# EAGLE design PH_074_isolated_SMD_rev1_2 (EAGLE 6.4)
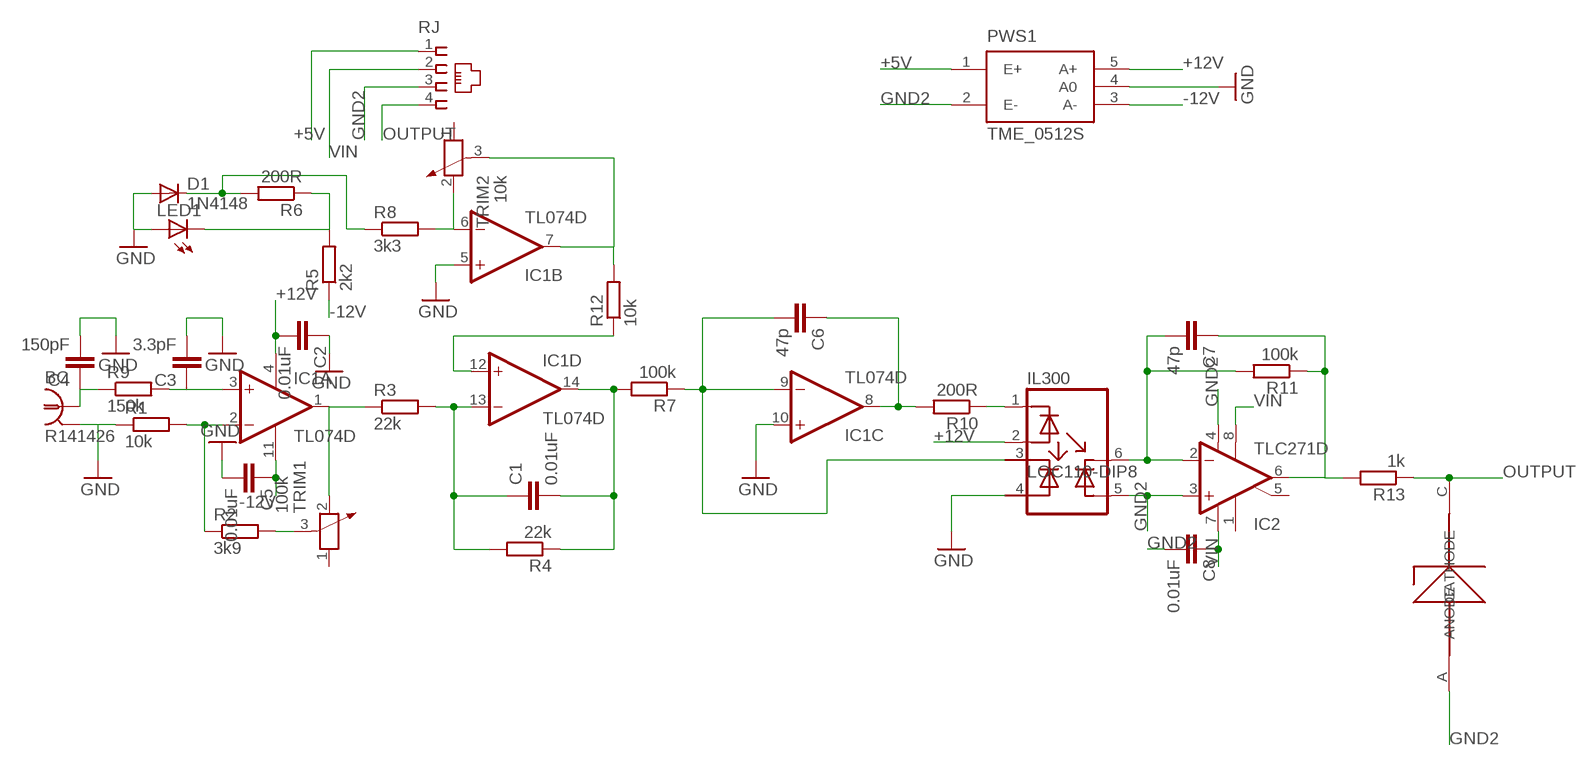
[diagram p0: schematic, sheet 1]

## Parts
BC  R141426  [R141426]
C1  0.01uF  C-EUC1206  [C1206]
C2  0.01uF  C-EUC1206  [C1206]
C3  3.3pF  C-EUC0805  [C0805]
C4  150pF  C-EUC0805  [C0805]
C5  0.01uF  C-EUC0805  [C0805]
C6  47p  C-EUC0805  [C0805]
C7  47p  C-EUC1206  [C1206]
C8  0.01uF  C-EUC0805  [C0805]
D1  1N4148  [R1206W]
IC1  TL074D  [SO14]
IC2  TLC271D  [SO08]
IL300  LOC110-DIP8  ILD621LOC110-DIP8  [DIP8]
LED1  LED3MM  [LED3MM]
PWS1  TME_0512S  [TMEXXXXS]
R1  10k  R-EU_R1206W  [R1206W]
R2  3k9  R-EU_R1206W  [R1206W]
R3  22k  R-EU_R1206W  [R1206W]
R4  22k  R-EU_R1206W  [R1206W]
R5  2k2  R-EU_R1206W  [R1206W]
R6  200R  R-EU_R1206W  [R1206W]
R7  100k  R-EU_R1206W  [R1206W]
R8  3k3  R-EU_R1206W  [R1206W]
R9  150k  R-EU_R0805W  [R0805W]
R10  200R  R-EU_R1206W  [R1206W]
R11  100k  R-EU_R1206W  [R1206W]
R12  10k  R-EU_R1206W  [R1206W]
R13  1k  R-EU_R1206W  [R1206W]
RJ  14867  [14867]
TRIM1  100k  POTENTIOMETER_PT-10  [PT-10]
TRIM2  10k  POTENTIOMETER_PT-10  [PT-10]
U$1  ZENER  [SOD80-W]

## Nets
+5V: PWS1.1(E+) RJ.1
+12V: C2.2 IC1.4(P:V+) IL300.2 PWS1.5(A+)
-12V: C5.1 IC1.11(P:V-) PWS1.3(A-) R5.1
GND: BC.2(GND) C2.1 C3.2 C4.2 C5.2 D1.1(A) IC1.5(B:+IN) IC1.10(C:+IN) IL300.4 LED1.A PWS1.4(A0) R1.1
GND2: C8.2 IC2.3(+IN) IC2.4(V-) IL300.5 PWS1.2(E-) RJ.3 U$1.A(ANODE)
IN: C1.2 IC1.14(D:OUT) R4.1 R7.2
N$1: IC1.6(B:-IN) R8.2 TRIM2.2
N$2: IC1.2(A:-IN) R1.2 R2.1
N$3: C3.1 IC1.3(A:+IN) R9.2
N$4: C6.2 IC1.9(C:-IN) IL300.3 R7.1
N$5: R2.2 TRIM1.3
N$6: BC.1 C4.1 R9.1
N$7: D1.2(C) R6.2 R8.1
N$8: LED1.K(C) R5.2 R6.1
N$9: IL300.1 R10.1
N$10: IC1.7(B:OUT) R12.2 TRIM2.3
N$12: IC1.1(A:OUT) R3.1 TRIM1.2
N$13: C6.1 IC1.8(C:OUT) R10.2
N$14: IC1.12(D:+IN) R12.1
N$17: C1.1 IC1.13(D:-IN) R3.2 R4.2
N$21: C7.2 IC2.2(-IN) IL300.6 R11.2
NIC: C7.1 IC2.6(OUT) R11.1 R13.2
OUTPUT: R13.1 RJ.4 U$1.C(CATHODE)
VIN: C8.1 IC2.7(V+) IC2.8(OPT) RJ.2
Unconnected: IC2.1(ON1) IC2.5(ON2) TRIM1.1 TRIM2.1

## Power pins joined to a net without a drawn wire
GND: BC.3(GND) BC.4(GND) BC.5(GND)

## Library data of the parts
BC = con-coax:R141426: BNC COAX CONNECTOR Radiall 50/75 Ohm Spoerle; MF: FARNELL; MPN: R141426161; OC_FARNELL: 4195115; OC_NEWARK: 14J7919
C1-C8 = rcl:C-EU: CAPACITOR, European symbol
D1 = Sensuino:1N4148: DIODE high speed (Philips)
IC1 = linear:TL074: OP AMP
IC2 = linear:TLC271: OP AMP
IL300 = Sensuino:ILD621: SIEMENS OPTO COUPLER
LED1 = candrian:LED: LED Through-hole
PWS1 = Sensuino:TME_*S: DC/DC Konverter 1 Watt Source: http://www.tracopower.com/datasheet_g/tme-d.pdf; MPN: TME 0512S; OC_FARNELL: 1007540; OC_NEWARK: 51R5323
R1-R13 = rcl:R-EU_: RESISTOR, European symbol
RJ = RJ11:14867: RJ11 Connector Source: 4UCON TECHNOLOGY INC. 14867.pdf; OC_FARNELL: unknown; OC_NEWARK: unknown
TRIM1 TRIM2 = rcl:POTENTIOMETER_: Potentiometer
U$1 = Sensuino:ZENER

## Board
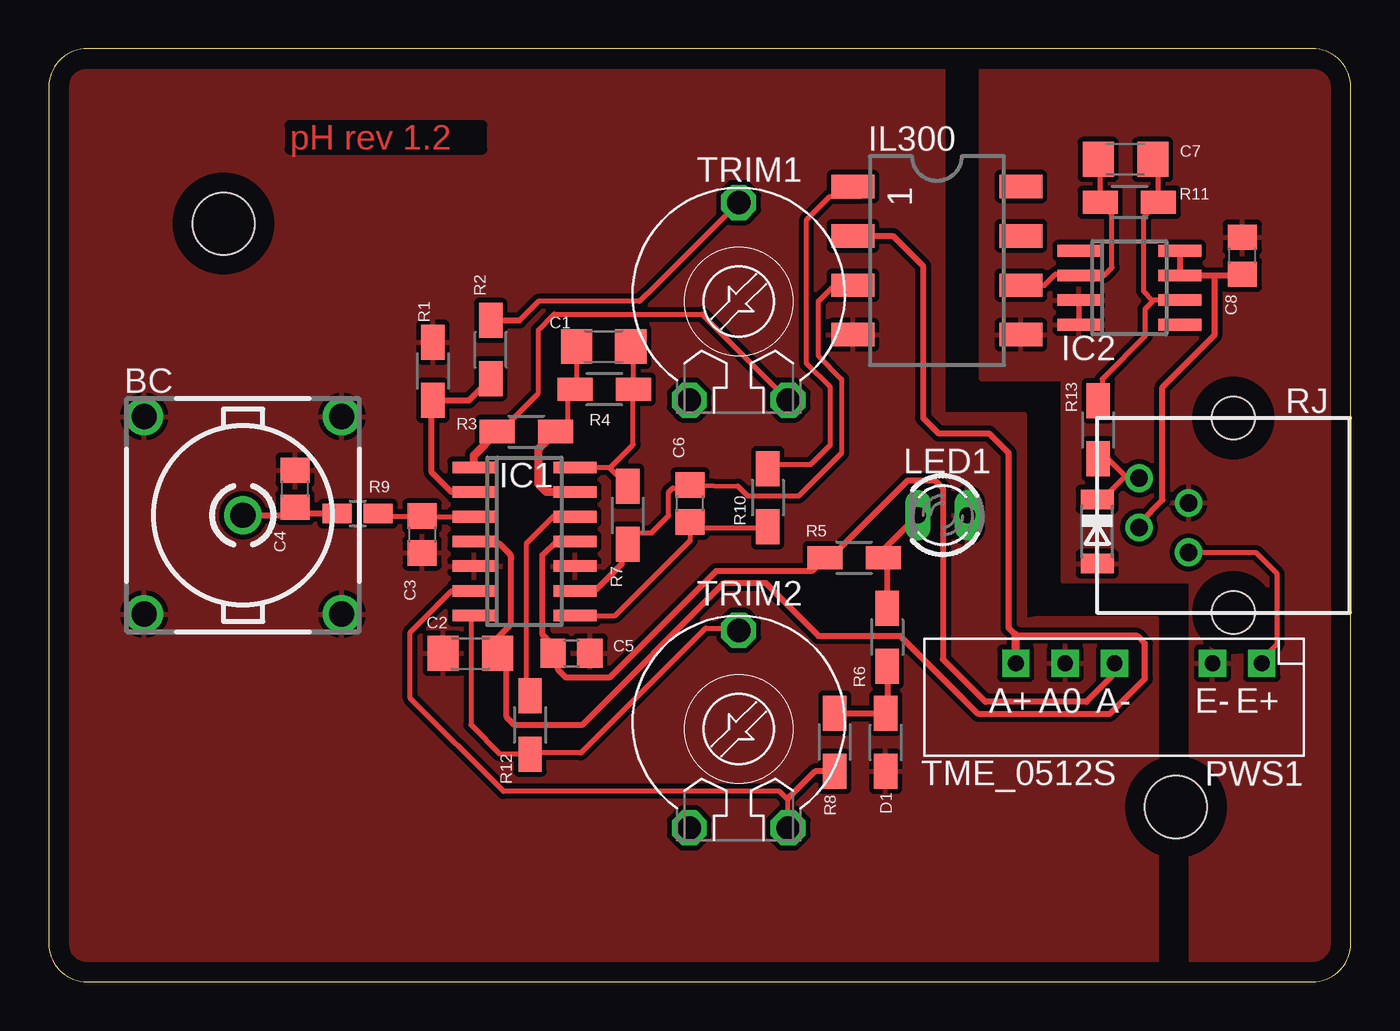
[diagram p1: board, top side]

Size 67 x 48 mm. Coordinates in mm from the lower left corner, seen from the top.
Outline: 0,46 0,2 arc90 2,0 65,0 arc90 67,2 67,46 arc90 65,48 2,48 arc90 0,46
Copper layers (1*16): Top 0.035mm / dielectric 1.5mm / Bottom 0.035mm
Design rules "default": minimum track width 10mil, minimum drill 24mil, track to track 8mil, track to pad 8mil, pad to pad 8mil, via to via 8mil, smd to smd 8mil, copper to edge 40mil, drill to drill 8mil, minimum pad ring 10mil, minimum via ring 8mil, stop-mask expansion 4mil, vias tented up to drill 0mil, thermal gap 10mil
Holes 3.2 mm at 9,39 58,9

### Footprints (pad centres in the part's own frame; a part is rotated, then mirrored left to right if it is on the bottom)
R141426 = drill 1.295: 1 0,0; 2 5.08,5.08; 3 -5.08,5.08; 4 -5.08,-5.08; 5 5.08,-5.08
C1206 = smd 1.6 x 1.8: 1 -1.4,0; 2 1.4,0
C0805 = smd 1.3 x 1.5: 1 -0.95,0; 2 0.95,0
R1206W = smd 1.8 x 1.2: 1 -1.499,0; 2 1.499,0
SO14 = smd 0.6 x 2.2: 1 -3.81,-2.6; 2 -2.54,-2.6; 3 -1.27,-2.6; 4 0,-2.6; 5 1.27,-2.6; 6 2.54,-2.6; 7 3.81,-2.6; 8 3.81,2.6; 9 2.54,2.6; 10 1.27,2.6; 11 0,2.6; 12 -1.27,2.6; 13 -2.54,2.6; 14 -3.81,2.6
SO08 = smd 0.6 x 2.2: 1 -1.905,-2.6; 2 -0.635,-2.6; 3 0.635,-2.6; 4 1.905,-2.6; 5 1.905,2.6; 6 0.635,2.6; 7 -0.635,2.6; 8 -1.905,2.6
DIP8 = smd 1.2 x 2.2: 1 -3.81,-4.318; 2 -1.27,-4.318; 3 1.27,-4.318; 4 3.81,-4.318; 5 3.81,4.318; 6 1.27,4.318; 7 -1.27,4.318; 8 -3.81,4.318
LED3MM = drill 0.8 long: A -1.27,0; K 1.27,0
TMEXXXXS = drill 0.813 pad 1.397 square: 1 2.15,1.25; 2 4.69,1.25; 3 9.73,1.25; 4 12.27,1.25; 5 14.81,1.25
R0805W = smd 1.5 x 1: 1 -1.052,0; 2 1.052,0
14867 = drill 0.9 pad 1.422: 1 -1.905,6.35; 2 -0.635,8.89; 3 0.635,6.35; 4 1.905,8.89 | hole 2.2: -5,4.05; 5,4.05
PT-10 = drill 1.2 pad 1.778 octagon: 1 -2.54,-5.08; 2 2.54,-5.08; 3 0,5.08
SOD80-W = smd 1 x 1.7: A 1.65,0; C -1.65,0

### Placement (x,y rotation side)
BC  10,24 90 top
C1  28.55,32.68 0 top
C2  21.7,16.9 0 top
C3  19.22,23.01 270 top
C4  12.68,25.36 90 top
C5  26.9,16.91 0 top
C6  33,24.6 90 top
C7  55.4,42.3 180 top
C8  61.41,37.35 90 top
D1  43.06,12.32 90 top
IC1  24.48,22.65 270 top
IC2  55.6,35.7 270 top
IL300  45.7,37.1 270 top
LED1  46,24 180 top
PWS1  64.57,17.64 180 top
R1  19.77,31.4 270 top
R2  22.74,32.53 90 top
R3  24.58,28.3 0 top
R4  28.58,30.48 180 top
R5  41.45,21.82 0 top
R6  43.15,17.72 270 top
R7  29.8,24 90 top
R8  40.44,12.33 270 top
R9  15.9,24.09 0 top
R10  37,24.9 270 top
R11  55.6,40.1 180 top
R12  24.77,13.21 270 top
R13  54,28.4 90 top
RJ  65,24 90 top
TRIM1  35.5,35 0 top
TRIM2  35.5,13 0 top
U$1  53.95,23.17 270 top

### Tracks (layer width: path | path; a pad name or v marks a point on that pad's centre or on a via)
+5V
  Top 0.254: 62.5,15.91 62.5,16.7 63.2,17.4 63.2,21 62.1,22.09 RJ.1
  Top 0.305: 62.5,15.91 PWS1.1
+12V
  Top 0.254: C2.2 22.65,17.12 arc-45 22.74,17.34 | IC1.4 21.98,22.55 | 41.93,38 IL300.2
  Top 0.305: 21.98,22.55 23.16,22.55 23.71,22.01 arc-45 23.8,21.79 23.8,18.4 22.74,17.34 | C2.2 23.57,16.43 23.57,13.61 23.98,13.21 27.43,13.21 34.75,20.52 36.88,20.52 39.6,17.8 43.8,17.8 47.8,13.8 54.6,13.8 56.4,15.6 56.4,17.4 56,17.8 49.96,17.8 49.76,17.6 | 49.76,17.84 49.4,18.2 49.4,27.2 48.4,28.2 45.8,28.2 45,29 45,36.8 43.43,38.37 IL300.2
  Top 0.406: PWS1.5 49.76,17.6 49.76,17.84
-12V
  Top 0.305: 27.03,22.7 26.15,22.7 25.4,21.95 25.4,17.88 26.01,17.27 26.01,16.56 C5.1 26.21,16.64 26.21,16.05 26.62,15.65 28.85,15.65 34.34,21.13 39.27,21.13 R5.1 | PWS1.3 54.84,15.84 53.4,14.4 48.2,14.4 46,16.6 46,25.4 45.6,25.8 44.2,25.8 40.6,22.2 40.34,22.2 R5.1 | R5.1 39.95,21.95
  Top 0.406: 27.03,22.7 IC1.11
GND
  pour Top (isolate 0.254): 1,47 46,47 46,29.2 50.2,29.2 50.2,18.6 50.8,18.7 57,18.7 57,1 0.8,1
GND2
  Top 0.254: IC2.3 IC2.4
  pour Top (isolate 0.254): 58.8,1 58.8,20.6 52.2,20.6 52.2,31 48,31 48,47 66.5,47 66.5,1
IN
  Top 0.254: IC1.14 28.84,26.46 | 28.84,26.46 R7.2 | 28.84,26.46 28.9,26.46 30.07,27.64 R4.1 30.08,32.55 C1.2
N$1
  Top 0.254: IC1.6 20.73,20.12 18.6,17.99 18.6,14.6 23.4,9.8 37.6,9.8 37.96,9.44 38.04,9.44 TRIM2.2
  Top 0.305: R8.2 39.43,10.83 38.04,9.44
N$2
  Top 0.305: IC1.2 20.73,25.19 19.71,26.21 19.71,29.84 R1.2 21.62,29.91 R2.1
N$3
  Top 0.254: 17.48,23.96 C3.1 | 19.46,23.92 IC1.3
  Top 0.406: 19.46,23.92 C3.1 | 17.48,23.96 R9.2
N$4
  Top 0.254: 29.8,23.1 31.02,23.1 31.9,23.98 31.9,25.2 32.11,25.4 32.9,25.4 C6.2 35.46,25.5 35.97,24.99 38.6,24.99 40.8,27.19 40.8,31 39.6,32.2 39.6,35 40.4,35.8 41.35,35.8 IL300.3 | 41.2,35.6 41.73,35.6 IL300.3 | 40.6,35.4 41.87,35.4 IL300.3
  Top 0.305: 27.16,20.2 28.2,20.2 29.5,21.5 29.5,22.2 R7.1
  Top 0.406: R7.1 29.8,23.1 | 32.8,25.3 C6.2 | 27.16,20.2 IC1.9
N$5
  Top 0.254: TRIM1.3 30.82,35.4 30.8,35.4 30.4,35 25.2,35 24.23,34.02
  Top 0.305: R2.2 24.23,34.02
N$6
  Top 0.305: BC.1 12.27,24 C4.1 13,24.09 R9.1
N$7
  Top 0.305: R6.2 43.15,13.9 D1.2 R8.1
N$8
  Top 0.305: R6.1 43.15,21.62 R5.2 42.95,22.22 LED1.K
N$9
  Top 0.254: 37.4,25.6 37,26 R10.1 37.2,26.6 39.2,26.6 40.2,27.6 40.2,30.6 39,31.8 39,39.2 39.4,39.6 40.2,40.4 41.79,40.4 IL300.1
  Top 0.406: R10.1 37,27
N$10
  Top 0.254: IC1.7 21.73,18.69 21.73,13.22 23.24,11.71 R12.2 24.85,11.79 27.39,11.79 33.8,18.2 35.38,18.2 TRIM2.3
N$12
  Top 0.254: R3.1 23.22,28.3 25.2,30.28 25.2,33.53 26.01,34.34 33.62,34.34 TRIM1.2
  Top 0.406: IC1.1 21.88,27.1 R3.1
N$13
  Top 0.254: IC1.8 29.14,18.84 33,22.7 C6.1 33.28,23.37 36.97,23.37 R10.2
  Top 0.406: 36.9,23.3 R10.2
N$14
  Top 0.254: 24.59,15.44 24.59,22.55 26.01,23.98 27.02,23.98 IC1.12
  Top 0.305: R12.1 24.77,15.26 24.59,15.44
N$17
  Top 0.254: 26.73,28.3 26.73,30.13 R4.2 27.15,30.55 C1.1
  Top 0.406: IC1.13 25.61,25.19 25.2,25.6 25.2,27.42 R3.2 26.73,28.3
N$21
  Top 0.254: C7.2 54.1,42.2 R11.2 54.71,39.49 54.71,36.74 54.3,36.34 IC2.2 52.94,36.4 51.8,36.4 51.23,35.83 IL300.6
NIC
  Top 0.254: IC2.6 56.79,35.06 | 56.79,35.06 56.33,35.52 56.33,39.34 R11.1 57.1,42 C7.1 | 56.79,35.06 56.79,34.99 56.4,34.6 56.4,33.2 54.2,31 54.2,30.1 R13.2 | 54.05,29.2 R13.2 | 54.2,29.7 R13.2
OUTPUT
  Top 0.254: U$1.C 54.22,24.82 55.4,26 | RJ.4 55.49,25.91 55.4,26 | R13.1 54.5,26.9 55.4,26
VIN
  Top 0.254: 58.98,36.33 IC2.7
  Top 0.305: RJ.2 56.11,23.6 57.3,24.79 57.3,30.6 59.99,33.29 59.99,36.33 | 58.98,36.33 59.99,36.33 | 59.99,36.33 61.35,36.33 C8.1 | IC2.8 IC2.7

### Text on the board
Top: pH rev 1.2
200bmp: + | - | GAIN | pH | + | - | by Sensuino | OFFSET